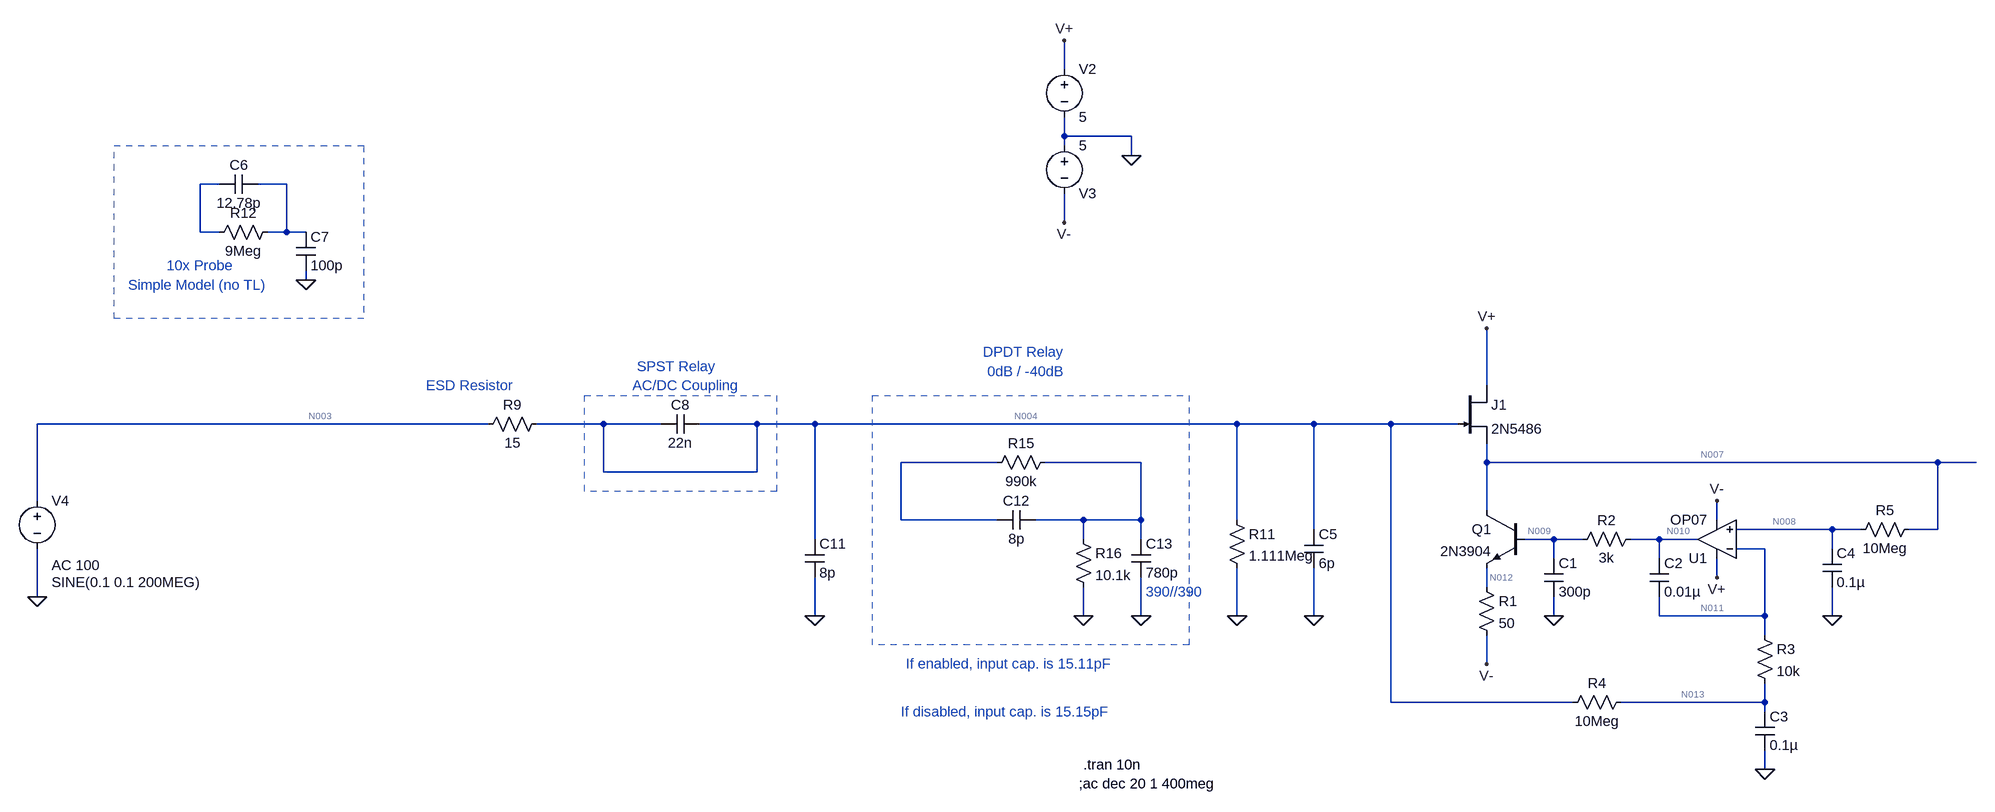
[diagram p0: schematic Rev3_Buffer_Amp_NoPreamp.asc]
Rev3_Buffer_Amp_NoPreamp.asc, the LTspice schematic file:
Version 4
SHEET 1 1796 912
WIRE -544 -448 -544 -496
WIRE -544 -336 -544 -368
WIRE -432 -336 -544 -336
WIRE -544 -320 -544 -336
WIRE -432 -304 -432 -336
WIRE -2144 -256 -2176 -256
WIRE -2032 -256 -2080 -256
WIRE -544 -192 -544 -240
WIRE -2176 -176 -2176 -256
WIRE -2144 -176 -2176 -176
WIRE -2032 -176 -2032 -256
WIRE -2032 -176 -2064 -176
WIRE -2000 -176 -2032 -176
WIRE -2000 -96 -2000 -112
WIRE 160 80 160 -16
WIRE -1504 144 -2448 144
WIRE -1312 144 -1424 144
WIRE -1216 144 -1312 144
WIRE -1056 144 -1152 144
WIRE -960 144 -1056 144
WIRE -256 144 -960 144
WIRE -128 144 -256 144
WIRE 0 144 -128 144
WIRE 112 144 0 144
WIRE -656 208 -816 208
WIRE -416 208 -576 208
WIRE 160 208 160 176
WIRE 912 208 160 208
WIRE 976 208 912 208
WIRE -1312 224 -1312 144
WIRE -1056 224 -1056 144
WIRE -1056 224 -1312 224
WIRE -2448 272 -2448 144
WIRE 160 288 160 208
WIRE -816 304 -816 208
WIRE -656 304 -816 304
WIRE -512 304 -592 304
WIRE -416 304 -416 208
WIRE -416 304 -512 304
WIRE -256 304 -256 144
WIRE 544 304 544 272
WIRE -128 320 -128 144
WIRE 736 320 576 320
WIRE 784 320 736 320
WIRE 912 320 912 208
WIRE 912 320 864 320
WIRE -960 336 -960 144
WIRE -512 336 -512 304
WIRE -416 336 -416 304
WIRE 272 336 224 336
WIRE 320 336 272 336
WIRE 448 336 400 336
WIRE 512 336 448 336
WIRE 624 352 576 352
WIRE 736 352 736 320
WIRE 272 368 272 336
WIRE 448 368 448 336
WIRE 544 400 544 368
WIRE 160 416 160 384
WIRE -2448 432 -2448 352
WIRE -960 464 -960 400
WIRE -512 464 -512 416
WIRE -416 464 -416 400
WIRE -256 464 -256 384
WIRE -128 464 -128 384
WIRE 272 464 272 432
WIRE 448 464 448 432
WIRE 624 464 624 352
WIRE 624 464 448 464
WIRE 736 464 736 416
WIRE 624 496 624 464
WIRE 160 544 160 496
WIRE 0 608 0 144
WIRE 304 608 0 608
WIRE 624 608 624 576
WIRE 624 608 384 608
WIRE 624 624 624 608
WIRE 624 720 624 688
FLAG 160 -16 V+
FLAG 160 544 V-
FLAG 544 272 V-
FLAG 544 400 V+
FLAG 272 464 0
FLAG 624 720 0
FLAG 736 464 0
FLAG -432 -304 0
FLAG -544 -496 V+
FLAG -544 -192 V-
FLAG -2448 432 0
FLAG -256 464 0
FLAG -128 464 0
FLAG -2000 -96 0
FLAG -960 464 0
FLAG -512 464 0
FLAG -416 464 0
SYMBOL njf 112 80 R0
SYMATTR InstName J1
SYMATTR Value 2N5486
SYMBOL npn 224 288 M0
SYMATTR InstName Q1
SYMATTR Value 2N3904
SYMBOL res 144 400 R0
SYMATTR InstName R1
SYMATTR Value 50
SYMBOL Opamps\\OP07 544 400 R180
SYMATTR InstName U1
SYMBOL res 416 320 R90
WINDOW 0 0 56 VBottom 2
WINDOW 3 32 56 VTop 2
SYMATTR InstName R2
SYMATTR Value 3k
SYMBOL cap 256 368 R0
SYMATTR InstName C1
SYMATTR Value 300p
SYMBOL cap 432 368 R0
SYMATTR InstName C2
SYMATTR Value 0.01µ
SYMBOL res 608 480 R0
SYMATTR InstName R3
SYMATTR Value 10k
SYMBOL cap 608 624 R0
SYMATTR InstName C3
SYMATTR Value 0.1µ
SYMBOL res 400 592 R90
WINDOW 0 0 56 VBottom 2
WINDOW 3 32 56 VTop 2
SYMATTR InstName R4
SYMATTR Value 10Meg
SYMBOL res 880 304 R90
WINDOW 0 0 56 VBottom 2
WINDOW 3 32 56 VTop 2
SYMATTR InstName R5
SYMATTR Value 10Meg
SYMBOL cap 720 352 R0
SYMATTR InstName C4
SYMATTR Value 0.1µ
SYMBOL voltage -544 -464 R0
WINDOW 123 0 0 Left 0
WINDOW 39 0 0 Left 0
SYMATTR InstName V2
SYMATTR Value 5
SYMBOL voltage -544 -336 R0
WINDOW 0 24 96 Left 2
WINDOW 3 24 16 Left 2
WINDOW 123 0 0 Left 0
WINDOW 39 0 0 Left 0
SYMATTR InstName V3
SYMATTR Value 5
SYMBOL voltage -2448 256 R0
WINDOW 3 24 152 Left 2
WINDOW 123 24 124 Left 2
WINDOW 39 0 0 Left 2
SYMATTR Value SINE(0.1 0.1 200MEG)
SYMATTR Value2 AC 100
SYMATTR InstName V4
SYMBOL res -1408 128 R90
WINDOW 0 0 56 VBottom 2
WINDOW 3 32 56 VTop 2
SYMATTR InstName R9
SYMATTR Value 15
SYMBOL res -272 288 R0
SYMATTR InstName R11
SYMATTR Value 1.111Meg
SYMBOL cap -144 320 R0
SYMATTR InstName C5
SYMATTR Value 6p
SYMBOL res -2048 -192 R90
WINDOW 0 0 56 VBottom 2
WINDOW 3 32 56 VTop 2
SYMATTR InstName R12
SYMATTR Value 9Meg
SYMBOL cap -2080 -272 R90
WINDOW 0 0 32 VBottom 2
WINDOW 3 32 32 VTop 2
SYMATTR InstName C6
SYMATTR Value 12.78p
SYMBOL cap -2016 -176 R0
SYMATTR InstName C7
SYMATTR Value 100p
SYMBOL cap -1152 128 R90
WINDOW 0 0 32 VBottom 2
WINDOW 3 32 32 VTop 2
SYMATTR InstName C8
SYMATTR Value 22n
SYMBOL cap -976 336 R0
SYMATTR InstName C11
SYMATTR Value 8p
SYMBOL res -560 192 R90
WINDOW 0 0 56 VBottom 2
WINDOW 3 32 56 VTop 2
SYMATTR InstName R15
SYMATTR Value 990k
SYMBOL cap -592 288 R90
WINDOW 0 0 32 VBottom 2
WINDOW 3 32 32 VTop 2
SYMATTR InstName C12
SYMATTR Value 8p
SYMBOL res -528 320 R0
SYMATTR InstName R16
SYMATTR Value 10.1k
SYMBOL cap -432 336 R0
SYMATTR InstName C13
SYMATTR Value 780p
TEXT -520 744 Left 2 !;ac dec 20 1 400meg
TEXT -512 712 Left 2 !.tran 10n
TEXT -1608 80 Left 2 ;ESD Resistor
TEXT -2232 -120 Left 2 ;10x Probe
TEXT -2296 -88 Left 2 ;Simple Model (no TL)
TEXT -680 24 Left 2 ;DPDT Relay
TEXT -672 56 Left 2 ;0dB / -40dB
TEXT -1256 48 Left 2 ;SPST Relay
TEXT -1264 80 Left 2 ;AC/DC Coupling
TEXT -808 544 Left 2 ;If enabled, input cap. is 15.11pF
TEXT -816 624 Left 2 ;If disabled, input cap. is 15.15pF
TEXT -408 424 Left 2 ;390//390
RECTANGLE Normal -1904 -32 -2320 -320 2
RECTANGLE Normal -336 512 -864 96 2
RECTANGLE Normal -1024 256 -1344 96 2

The netlist it stands for:
* Rev3_Buffer_Amp_NoPreamp.asc
J1 V+ N004 N007 2N5486
Q1 N007 N009 N012 0 2N3904
R1 N012 V- 50
XU1 N008 N011 V+ V- N010 LT1001  ; OP07, pins In+ In- V+ V- OUT
R2 N010 N009 3k
C1 N009 0 300p
C2 N010 N011 0.01µ
R3 N011 N013 10k
C3 N013 0 0.1µ
R4 N013 N004 10Meg
R5 N007 N008 10Meg
C4 N008 0 0.1µ
V2 V+ 0 5
V3 0 V- 5
V4 N003 0 SINE(0.1 0.1 200MEG) AC 100
R9 N004 N003 15
R11 N004 0 1.111Meg
C5 N004 0 6p
R12 N002 N001 9Meg
C6 N002 N001 12.78p
C7 N002 0 100p
C8 N004 N004 22n
C11 N004 0 8p
R15 N006 N005 990k
C12 N006 N005 8p
R16 N006 0 10.1k
C13 N006 0 780p
.model NPN NPN
.model PNP PNP
.lib standard.bjt
.model NJF NJF
.model PJF PJF
.lib standard.jft
;ac dec 20 1 400meg
.tran 10n
* ESD Resistor
* 10x Probe
* Simple Model (no TL)
* DPDT Relay
* 0dB / -40dB
* SPST Relay
* AC/DC Coupling
* If enabled, input cap. is 15.11pF
* If disabled, input cap. is 15.15pF
* 390//390
.lib LTC.lib
.backanno
.end

* Results of the author's LTspice run, read from the files saved beside the schematic
* Operating Point, zero values left out:
*   V(v+) = 5 V
*   V(n004) = 100 mV
*   V(n007) = 100 mV
*   V(n009) = -1.688 V
*   V(n012) = -2.456 V
*   V(v-) = -5 V
*   V(n011) = 100 mV
*   V(n008) = 100 mV
*   V(n010) = -1.127 V
*   V(n013) = 100 mV
*   V(n003) = 100 mV
*   Ic(Q1) = 50.7 mA
*   Ib(Q1) = 186.7 µA
*   Ie(Q1) = -50.89 mA
*   Id(J1) = 50.7 mA
*   Ig(J1) = -5.4 pA
*   Is(J1) = -50.7 mA
*   I(R11) = 90.01 nA
*   I(R9) = -90 nA
*   I(R2) = 186.7 µA
*   I(R1) = 50.89 mA
*   I(V4) = -90 nA
*   I(V3) = -53.04 mA
*   I(V2) = -53.04 mA
*   Ix(u1:3) = 2.344 mA
*   Ix(u1:4) = -2.158 mA
*   Ix(u1:5) = -186.7 µA
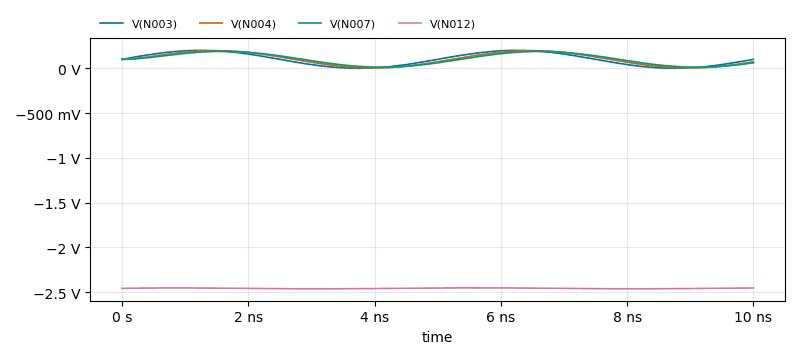
[diagram p1: Transient Analysis of Rev3_Buffer_Amp_NoPreamp.asc, plotted from the saved traces]
* Transient Analysis, 1 run:
*   V(N003): min 3.765 µV, max 200 mV, average 100 mV, rms 122.6 mV, last 100 mV
*   V(N004): min 3.646 mV, max 196.3 mV, average 100.6 mV, rms 121.6 mV, last 71.96 mV
*   V(N007): min 11.91 mV, max 188.8 mV, average 101.4 mV, rms 119.2 mV, last 61.13 mV
*   V(N012): min -2.461 V, max -2.45 V, average -2.456 V, rms 2.456 V, last -2.452 V